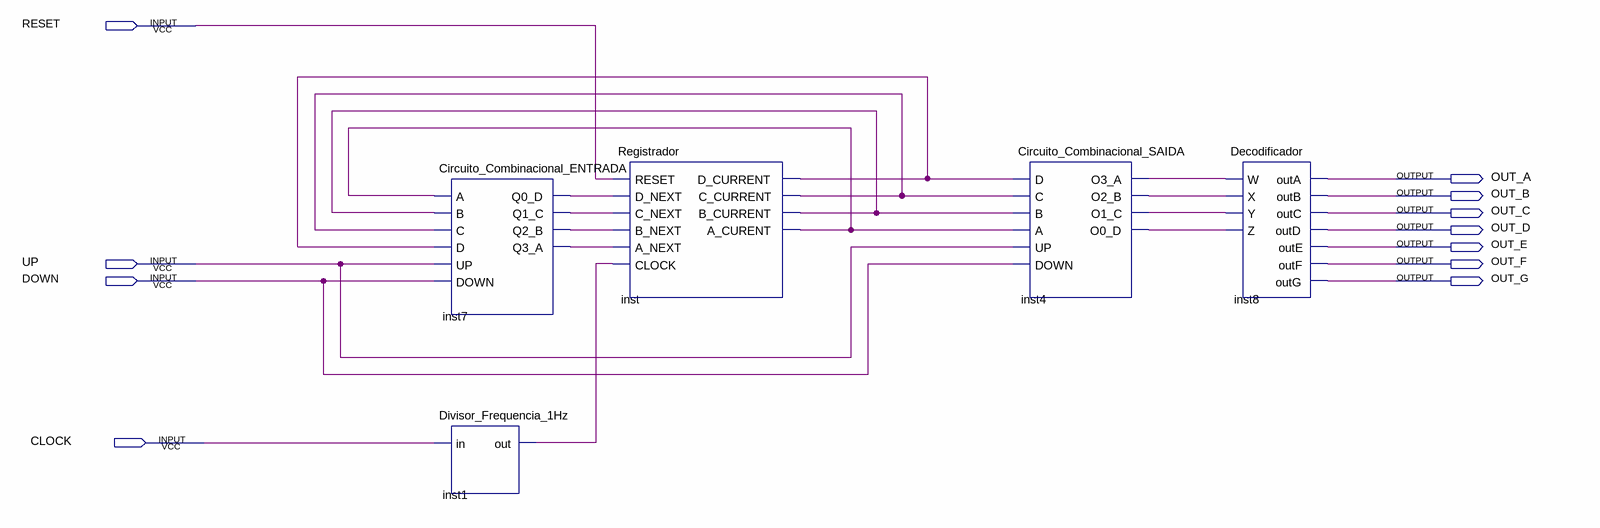
[diagram p0: schematic sheet]
// Quartus schematic mealy.bdf as structural Verilog: 5 symbols, 11 pins
module mealy (
  input  RESET,
  input  UP,
  input  DOWN,
  input  CLOCK,
  output OUT_A,
  output OUT_B,
  output OUT_C,
  output OUT_D,
  output OUT_E,
  output OUT_F,
  output OUT_G
);

  wire inst1_out, inst4_o0_d, inst4_o1_c, inst4_o2_b, inst4_o3_a, inst7_q0_d, inst7_q1_c, inst7_q2_b,
       inst7_q3_a, inst_a_curent, inst_b_current, inst_c_current, inst_d_current;

  Circuito_Combinacional_ENTRADA inst7 (
    .A(inst_a_curent), .B(inst_b_current), .C(inst_c_current), .D(inst_d_current), .UP(UP), .DOWN(DOWN),
    .Q0_D(inst7_q0_d), .Q1_C(inst7_q1_c), .Q2_B(inst7_q2_b), .Q3_A(inst7_q3_a));
  Divisor_Frequencia_1Hz inst1 (.in(CLOCK), .out(inst1_out));
  Registrador inst (
    .RESET(RESET), .D_NEXT(inst7_q0_d), .C_NEXT(inst7_q1_c), .B_NEXT(inst7_q2_b), .A_NEXT(inst7_q3_a),
    .CLOCK(inst1_out), .D_CURRENT(inst_d_current), .C_CURRENT(inst_c_current), .B_CURRENT(inst_b_current),
    .A_CURENT(inst_a_curent));
  Circuito_Combinacional_SAIDA inst4 (
    .D(inst_d_current), .C(inst_c_current), .B(inst_b_current), .A(inst_a_curent), .UP(UP), .DOWN(DOWN),
    .O3_A(inst4_o3_a), .O2_B(inst4_o2_b), .O1_C(inst4_o1_c), .O0_D(inst4_o0_d));
  Decodificador inst8 (
    .W(inst4_o3_a), .X(inst4_o2_b), .Y(inst4_o1_c), .Z(inst4_o0_d), .outA(OUT_A), .outB(OUT_B), .outC(OUT_C),
    .outD(OUT_D), .outE(OUT_E), .outF(OUT_F), .outG(OUT_G));
endmodule
